# Altium schematic sheet TP_IHM_7SEG_DRIVERS.SchDoc
size A4
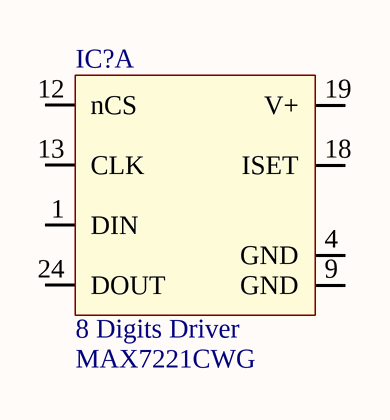
[diagram p0: TP_IHM_7SEG_DRIVERS.SchDoc]

## Parts
IC?  8 Digits Driver  [MAX7221CWG]  (part A of 3)

## Nets

Not connected (* = marked no-connect by the designer): IC? 1(DIN) 4(GND) 9(GND) 12(nCS) 13(CLK) 18(ISET) 19(V+) 24(DOUT)

## Library data of the parts
IC? = MAX7221: MAX7221 8 Digit 7 Segments Display; Reference: MAX7221CWG